# EAGLE design C64_KernalSw_8k (EAGLE 9.5.2)
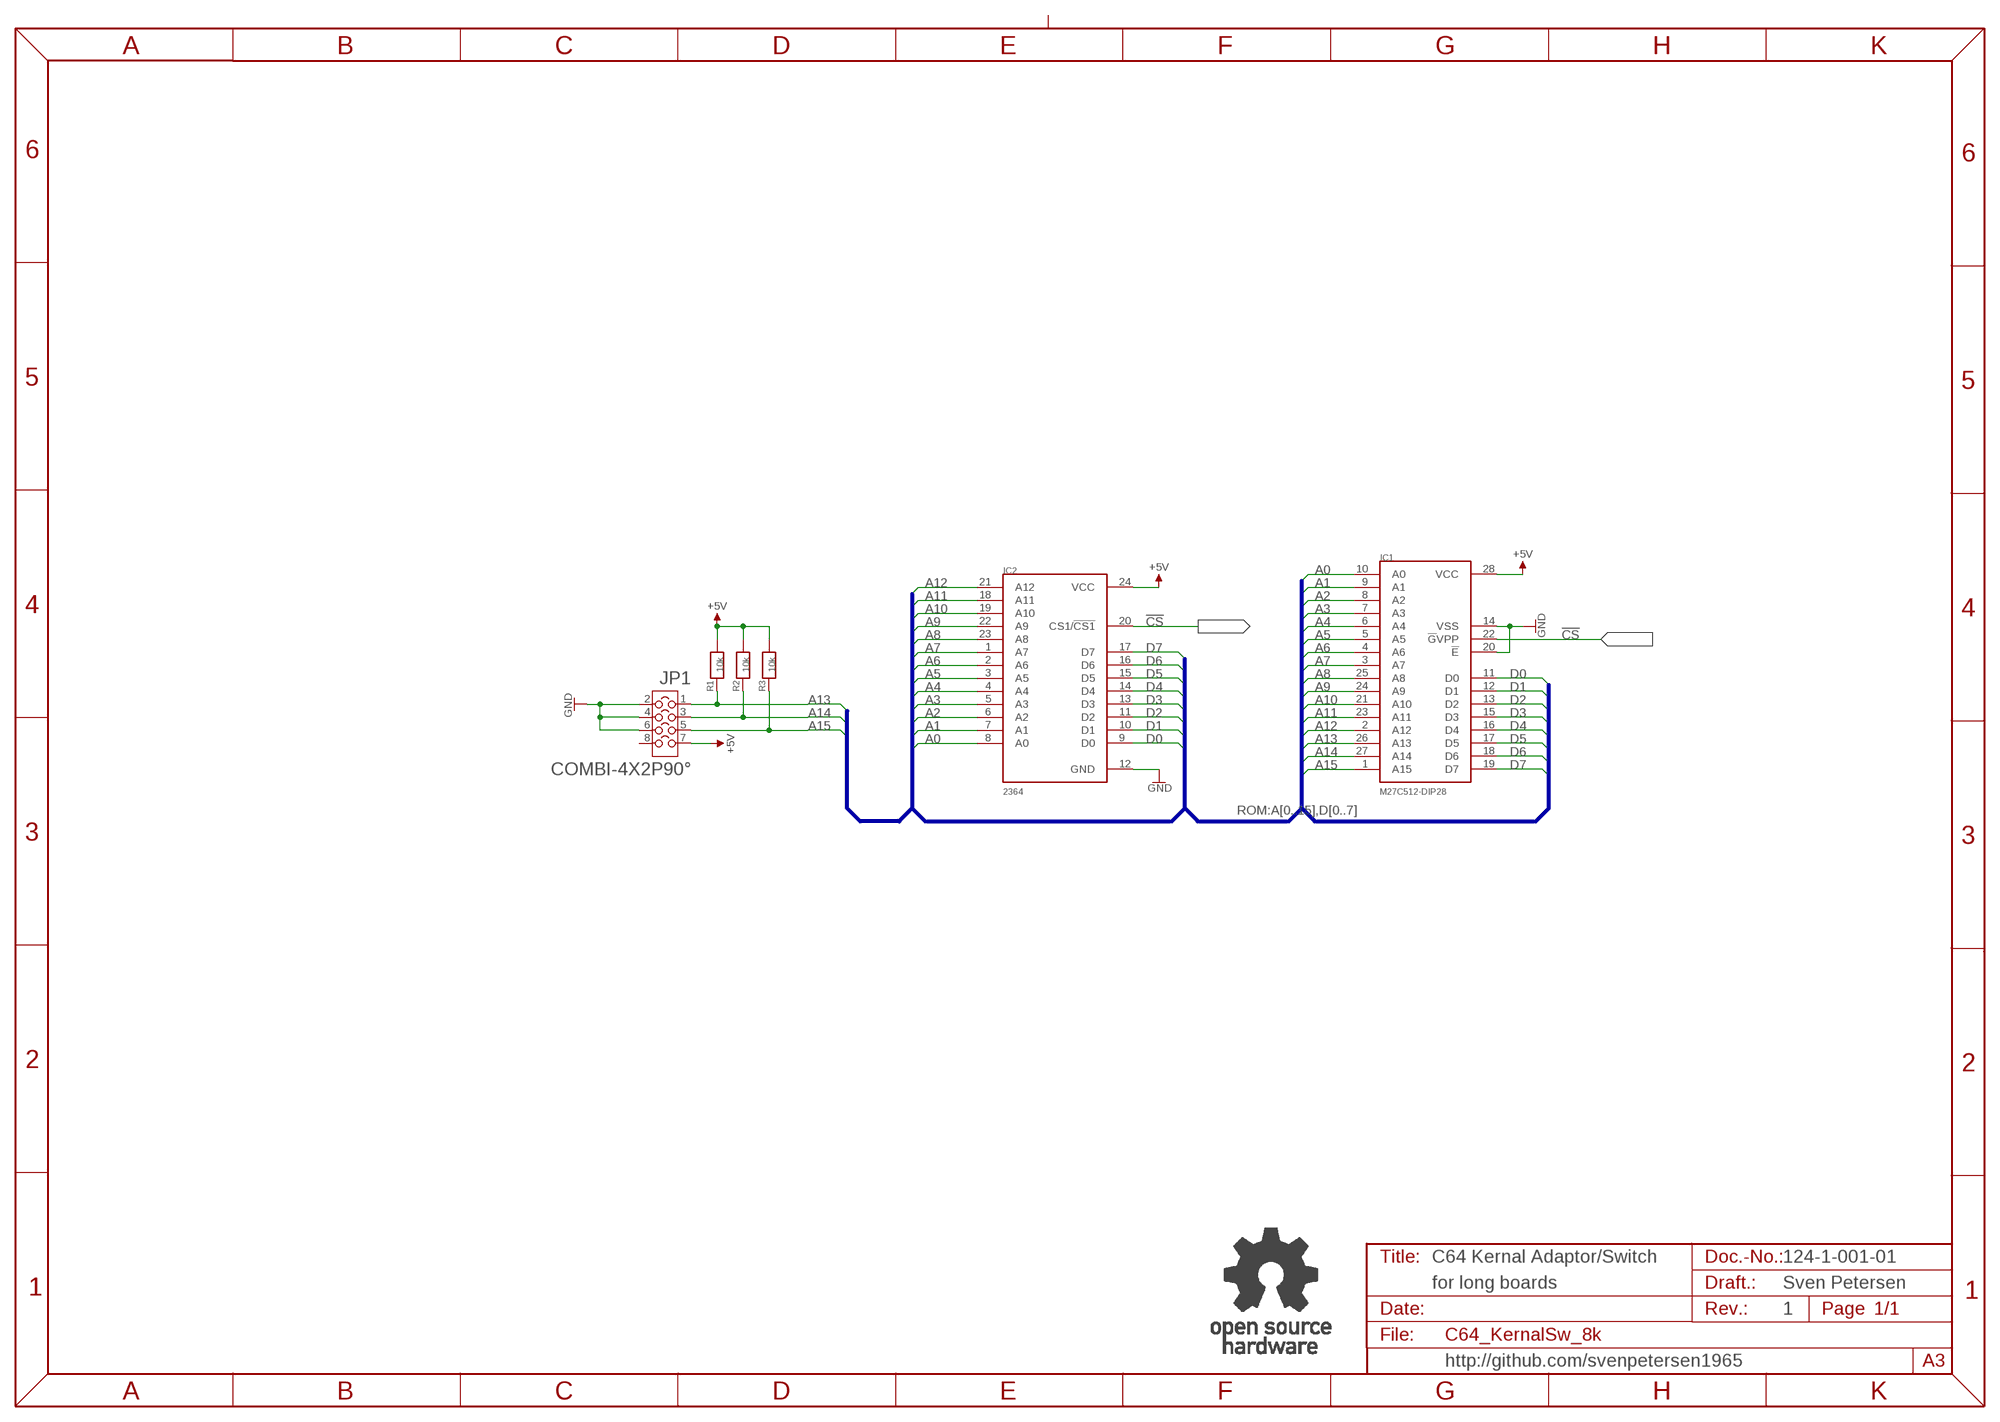
[diagram p0: schematic, sheet 1]

## Parts
IC1  M27C512-DIP28  [DIL28-6]
IC2  2364  [DIL24_SOCKET]
JP1  COMBI-4X2P90°  [COMBI-4X2-90]
R1  10k  R-0805  [0805]
R2  10k  R-0805  [0805]
R3  10k  R-0805  [0805]
U$11  OPEN_SOURCE_HW  [OPENHW]

## Nets
!CS: IC1.22(!G!VPP) IC2.20(CS1/!CS1)
+5V: IC1.28(VCC) IC2.24(VCC) JP1.7 R1.2 R2.2 R3.2
A0: IC1.10(A0) IC2.8(A0)
A1: IC1.9(A1) IC2.7(A1)
A2: IC1.8(A2) IC2.6(A2)
A3: IC1.7(A3) IC2.5(A3)
A4: IC1.6(A4) IC2.4(A4)
A5: IC1.5(A5) IC2.3(A5)
A6: IC1.4(A6) IC2.2(A6)
A7: IC1.3(A7) IC2.1(A7)
A8: IC1.25(A8) IC2.23(A8)
A9: IC1.24(A9) IC2.22(A9)
A10: IC1.21(A10) IC2.19(A10)
A11: IC1.23(A11) IC2.18(A11)
A12: IC1.2(A12) IC2.21(A12)
A13: IC1.26(A13) JP1.1 R1.1
A14: IC1.27(A14) JP1.3 R2.1
A15: IC1.1(A15) JP1.5 R3.1
D0: IC1.11(D0) IC2.9(D0)
D1: IC1.12(D1) IC2.10(D1)
D2: IC1.13(D2) IC2.11(D2)
D3: IC1.15(D3) IC2.13(D3)
D4: IC1.16(D4) IC2.14(D4)
D5: IC1.17(D5) IC2.15(D5)
D6: IC1.18(D6) IC2.16(D6)
D7: IC1.19(D7) IC2.17(D7)
GND: IC1.14(VSS) IC1.20(!E) IC2.12(GND) JP1.2 JP1.4 JP1.6
Unconnected: JP1.8

## Buses
ROM:A[0..15],D[0..7]

## Notes on the sheet
- C64 Kernal Adaptor/Switch | 124-1-001-01
- for long boards | Sven Petersen
- 1
- http://github.com/svenpetersen1965

## Library data of the parts
IC1 = ST:M27C512
IC2 = MOS:2364
JP1 = Cutpad:COMBI-4X2P
R1-R3 = SMD:R-0805
U$11 = Logo:OPEN_SOURCE_HW

## Board
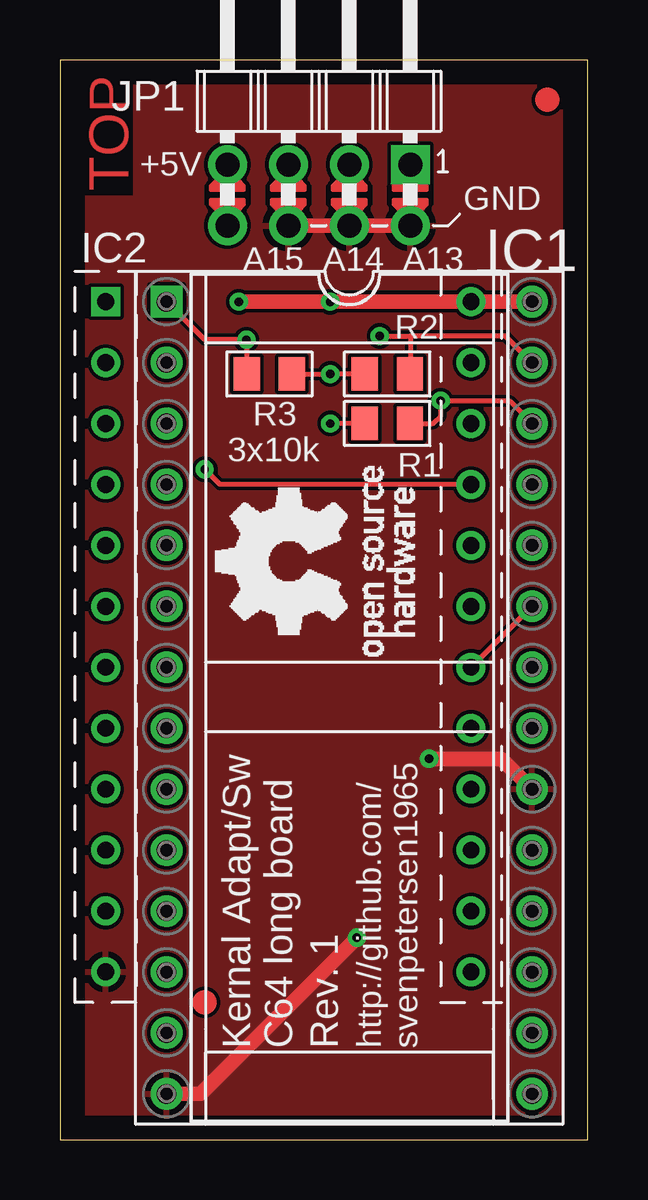
[diagram p1: board, top side]
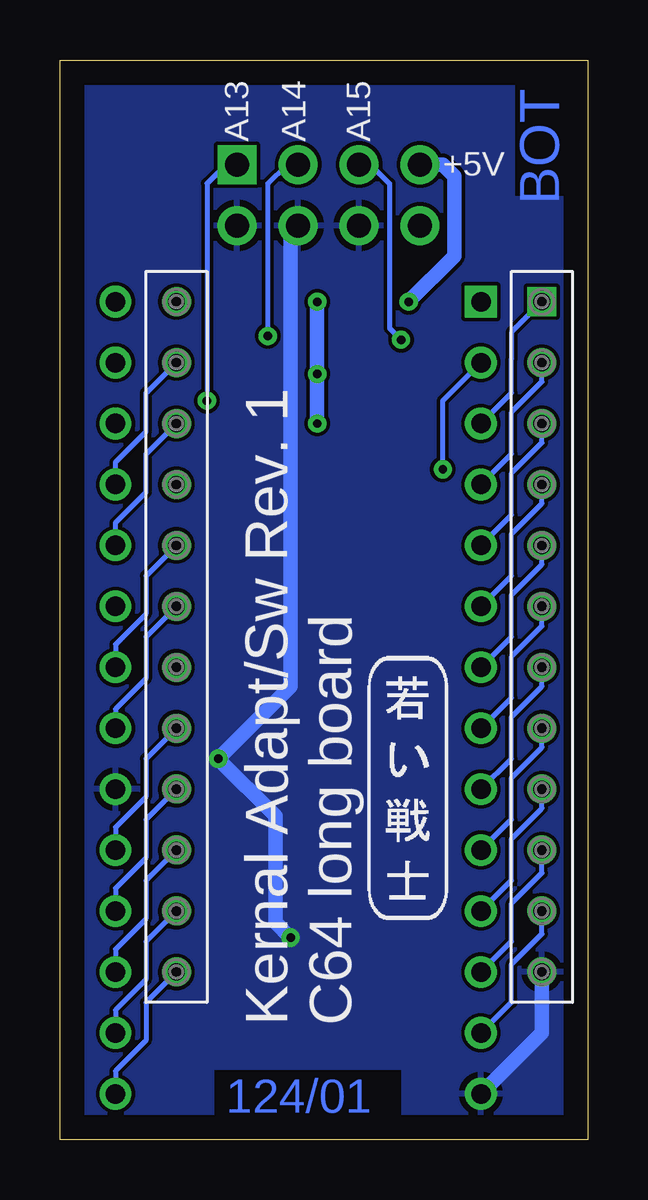
[diagram p2: board, bottom side, seen from below]

Size 22 x 45 mm. Coordinates in mm from the lower left corner, seen from the top.
Outline: 0,0 22,0 22,45 0,45 0,0
Copper layers (1*16): Top 0.035mm / dielectric 1.5mm / Bottom 0.035mm
Design rules "default *": minimum track width 6mil, minimum drill 0.35mm, track to track 6mil, track to pad 6mil, pad to pad 6mil, via to via 6mil, smd to smd 6mil, copper to edge 40mil, drill to drill 6mil, minimum pad ring 10mil, minimum via ring 8mil, stop-mask expansion 4mil, vias tented up to drill 24mil, thermal gap 10mil
bRestrict: 3 lines

### Footprints (pad centres in the part's own frame; a part is rotated, then mirrored left to right if it is on the bottom)
DIL28-6 = drill 0.813 square: 1 -16.51,-7.62 | drill 0.813: 2 -13.97,-7.62; 3 -11.43,-7.62; 4 -8.89,-7.62; 5 -6.35,-7.62; 6 -3.81,-7.62; 7 -1.27,-7.62; 8 1.27,-7.62; 9 3.81,-7.62; 10 6.35,-7.62; 11 8.89,-7.62; 12 11.43,-7.62; 13 13.97,-7.62; 14 16.51,-7.62; 15 16.51,7.62; 16 13.97,7.62; 17 11.43,7.62; 18 8.89,7.62; 19 6.35,7.62; 20 3.81,7.62; 21 1.27,7.62; 22 -1.27,7.62; 23 -3.81,7.62; 24 -6.35,7.62; 25 -8.89,7.62; 26 -11.43,7.62; 27 -13.97,7.62; 28 -16.51,7.62
DIL24_SOCKET = drill 0.7 square: 1 -13.97,-7.62 | drill 0.7: 2 -11.43,-7.62; 3 -8.89,-7.62; 4 -6.35,-7.62; 5 -3.81,-7.62; 6 -1.27,-7.62; 7 1.27,-7.62; 8 3.81,-7.62; 9 6.35,-7.62; 10 8.89,-7.62; 11 11.43,-7.62; 12 13.97,-7.62; 13 13.97,7.62; 14 11.43,7.62; 15 8.89,7.62; 16 6.35,7.62; 17 3.81,7.62; 18 1.27,7.62; 19 -1.27,7.62; 20 -3.81,7.62; 21 -6.35,7.62; 22 -8.89,7.62; 23 -11.43,7.62; 24 -13.97,7.62
COMBI-4X2-90 = drill 1 pad 1.626 square: 1 -1.27,3.81 | drill 1 pad 1.626: 2 1.27,3.81; 3 -1.27,1.27; 4 1.27,1.27; 5 -1.27,-1.27; 6 1.27,-1.27; 7 -1.27,-3.81; 8 1.27,-3.81
0805 = smd 1.092 x 1.397: 1 -0.94,0; 2 0.94,0

### Placement (x,y rotation side)
IC1  12.06,18.41 270 top
IC2  9.53,20.95 270 top
JP1  10.79,39.37 270 top
R1  13.65,29.84 180 top
R2  13.65,31.91 180 top
R3  8.73,31.91 0 top
U$6  [SVEN_TAG]  7.46,14.76 0 bottom
U$11  14.76,20.16 90 top
U$16  [GS28P]  12.06,18.41 270 top
U$17  [SMD_REF_R1MM]  20.32,43.34 0 top
U$18  [SMD_REF_R1MM]  6.03,5.71 0 top
U$19  [2LAYER]  2.86,39.53 90 top
U$20  [PCB-TITLE/]  0,58.58 0 top  (outside the outline)

### Tracks (layer width: path | path; a pad name or v marks a point on that pad's centre or on a via)
!CS
  Bottom 0.203: IC2.20 18.41,23.5 18.41,21.91 19.68,20.64 IC1.22
+5V  (via drill 0.35)
  Top 0.203: R3.2 v11.27,31.91 R2.2 | R1.2 v11.27,29.84
  Top 0.61: IC1.28 IC2.24 v11.27,34.92 v7.46,34.92
  Bottom 0.61: v11.27,34.92 v11.27,31.91 v11.27,29.84 | JP1.7 6.03,40.64 5.56,40.16 5.56,36.83 v7.46,34.92
A0
  Bottom 0.203: IC1.10 3.17,13.34 3.17,15.08 1.91,16.35 IC2.8
A1
  Bottom 0.203: IC1.9 3.17,15.88 3.17,17.62 1.91,18.89 IC2.7
A2
  Bottom 0.203: IC1.8 3.17,18.41 3.17,20.14 1.91,21.41 IC2.6
A3
  Bottom 0.203: IC1.7 3.17,20.95 3.17,22.7 1.91,23.97 IC2.5
A4
  Bottom 0.203: IC1.6 3.17,23.5 3.17,25.24 1.91,26.51 IC2.4
A5
  Bottom 0.203: IC1.5 3.17,26.04 3.17,27.78 1.91,29.05 IC2.3
A6
  Bottom 0.203: IC1.4 3.17,28.57 3.17,30.32 1.91,31.59 IC2.2
A7
  Bottom 0.203: IC2.1 3.17,33.66 3.17,32.54 3.17,31.11 IC1.3
A8
  Bottom 0.203: IC1.25 19.68,28.23 18.41,29.5 18.41,31.11 IC2.23
A9
  Bottom 0.203: IC1.24 19.68,25.72 18.41,26.99 18.41,28.57 IC2.22
A10
  Bottom 0.203: IC2.19 18.41,20.95 18.41,19.21 19.68,17.94 IC1.21
A11
  Top 0.203: IC1.23 IC2.18
A12  (via drill 0.35)
  Top 0.203: IC2.21 6.67,27.3 v6.03,27.94
  Bottom 0.203: IC1.2 6.03,30.8 v6.03,27.94
A13  (via drill 0.35)
  Top 0.203: IC1.26 18.73,30.8 v15.88,30.8 15.88,30.16 15.56,29.84 R1.1
  Bottom 0.203: JP1.1 15.08,40.64 15.88,39.85 v15.88,30.8
A14  (via drill 0.35)
  Top 0.203: IC1.27 18.57,33.5 14.61,33.5 | 14.61,33.5 14.61,31.92 R2.1 | v13.34,33.5 14.61,33.5
  Bottom 0.203: JP1.3 12.54,40.64 13.34,39.85 v13.34,33.5
A15  (via drill 0.35)
  Top 0.203: R3.1 v7.78,33.34 6.03,33.34 IC1.1
  Bottom 0.203: JP1.5 9.05,40.64 8.26,39.85 8.26,33.81 v7.78,33.34
D0
  Bottom 0.203: IC1.11 3.17,10.79 3.17,12.54 1.91,13.81 IC2.9
D1
  Bottom 0.203: IC1.12 3.17,8.26 3.17,9.84 1.91,11.11 IC2.10
D2
  Bottom 0.203: IC1.13 3.17,5.71 3.17,7.3 1.91,8.57 IC2.11
D3
  Bottom 0.203: IC2.13 18.41,5.71 18.41,4.13 19.68,2.86 IC1.15
D4
  Bottom 0.203: IC2.14 18.41,8.26 18.41,6.67 19.68,5.4 IC1.16
D5
  Bottom 0.203: IC2.15 18.41,10.79 18.41,9.21 19.68,7.94 IC1.17
D6
  Bottom 0.203: IC2.16 18.41,13.34 18.41,11.75 19.68,10.48 IC1.18
D7
  Bottom 0.203: IC2.17 18.41,15.88 18.41,14.29 19.68,13.02 IC1.19
GND  (via drill 0.35)
  Top 0.61: JP1.6 JP1.4 JP1.2 | v12.38,8.41 5.87,1.91 IC1.14 | IC1.20 18.41,15.88 v15.4,15.88
  Bottom 0.61: JP1.4 12.38,37.78 12.38,20.64 12.38,18.89 v15.4,15.88 13.02,13.49 13.02,9.05 v12.38,8.41 | IC1.14 1.91,4.45 IC2.12
  pour Top: 0.64,0.64 21.27,0.64 21.27,44.13 0.64,44.13
  pour Bottom: 0.64,0.64 21.27,0.64 21.27,44.13 0.64,44.13

### Text on the board
Bottom: 124/01
tPlace: +5V | GND | A15 | A14 | A13 | Kernal Adapt/Sw / C64 long board | Rev. 1
bPlace: A15 | A14 | A13 | +5V | Kernal Adapt/Sw Rev. 1 / C64 long board
tNames: 3x10k | http://github.com/ / svenpetersen1965
Document: Sven Petersen | 124-2-01-01 | 2021 | 35µm | 2 | 1